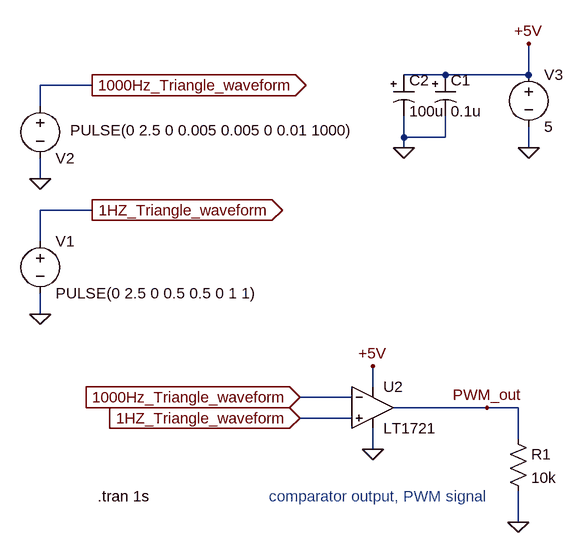
[diagram p0: schematic tri_waveform_comparator_PWM.asc]
tri_waveform_comparator_PWM.asc, the LTspice schematic file:
Version 4
SHEET 1 880 680
WIRE 448 -320 384 -320
WIRE 576 -320 576 -368
WIRE 576 -320 448 -320
WIRE -96 -304 -176 -304
WIRE -176 -272 -176 -304
WIRE 384 -224 384 -256
WIRE 448 -224 448 -256
WIRE 448 -224 384 -224
WIRE 384 -208 384 -224
WIRE 576 -208 576 -240
WIRE -176 -160 -176 -192
WIRE -96 -112 -176 -112
WIRE -176 -64 -176 -112
WIRE -176 48 -176 16
WIRE 336 160 336 128
WIRE 304 176 224 176
WIRE 512 192 368 192
WIRE 560 192 512 192
WIRE 304 208 224 208
WIRE 560 240 560 192
WIRE 336 256 336 224
WIRE 560 368 560 320
FLAG -176 48 0
FLAG -176 -160 0
FLAG 336 256 0
FLAG 576 -208 0
FLAG 384 -208 0
FLAG 560 368 0
FLAG -96 -304 1000Hz_Triangle_waveform
IOPIN -96 -304 Out
FLAG -96 -112 1HZ_Triangle_waveform
IOPIN -96 -112 Out
FLAG 576 -368 +5V
FLAG 336 128 +5V
FLAG 224 176 1000Hz_Triangle_waveform
IOPIN 224 176 In
FLAG 224 208 1HZ_Triangle_waveform
IOPIN 224 208 In
FLAG 512 192 PWM_out
SYMBOL Comparators\\LT1721 336 128 R0
SYMATTR InstName U2
SYMBOL voltage -176 -80 R0
WINDOW 123 0 0 Left 0
WINDOW 39 0 0 Left 0
SYMATTR InstName V1
SYMATTR Value PULSE(0 2.5 0 0.5 0.5 0 1 1)
SYMBOL voltage -176 -288 R0
WINDOW 0 24 96 Left 2
WINDOW 3 46 53 Left 2
WINDOW 123 0 0 Left 0
WINDOW 39 0 0 Left 0
SYMATTR InstName V2
SYMATTR Value PULSE(0 2.5 0 0.005 0.005 0 0.01 1000)
SYMBOL voltage 576 -336 R0
WINDOW 123 0 0 Left 0
WINDOW 39 0 0 Left 0
SYMATTR InstName V3
SYMATTR Value 5
SYMBOL polcap 432 -320 R0
WINDOW 3 24 56 Left 2
SYMATTR InstName C1
SYMATTR Value 0.1u
SYMATTR Description Capacitor
SYMATTR Type cap
SYMATTR SpiceLine V=16 Irms=0 Rser=11 Lser=0
SYMBOL polcap 368 -320 R0
WINDOW 3 24 56 Left 2
SYMATTR InstName C2
SYMATTR Value 100u
SYMATTR Description Capacitor
SYMATTR Type cap
SYMATTR SpiceLine V=16 Irms=0 Rser=11 Lser=0 mfg="AVX" pn="TAJA105K016" type="Tantalum"
SYMBOL res 544 224 R0
SYMATTR InstName R1
SYMATTR Value 10k
TEXT -88 328 Left 2 !.tran 1s
TEXT 176 328 Left 2 ;comparator output, PWM signal

The netlist it stands for:
* tri_waveform_comparator_PWM.asc
XU2 1HZ_Triangle_waveform 1000Hz_Triangle_waveform +5V 0 PWM_out LT1720  ; LT1721, pins In+ In- V+ V- OUT
V1 1HZ_Triangle_waveform 0 PULSE(0 2.5 0 0.5 0.5 0 1 1)
V2 1000Hz_Triangle_waveform 0 PULSE(0 2.5 0 0.005 0.005 0 0.01 1000)
V3 +5V 0 5
C1 +5V 0 0.1u V=16 Irms=0 Rser=11 Lser=0
C2 +5V 0 100u V=16 Irms=0 Rser=11 Lser=0 mfg="AVX" pn="TAJA105K016" type="Tantalum"
R1 PWM_out 0 10k
.tran 1s
* comparator output, PWM signal
.lib LTC.lib
.backanno
.end